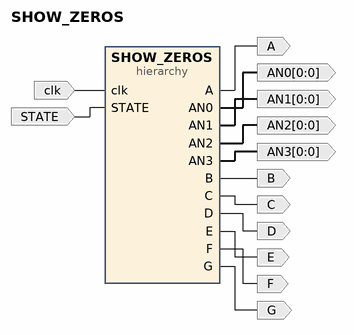
[diagram p0: block diagram of the top level]
# Vivado block design SHOW_ZEROS, xc7a35tcpg236-1, Vivado 2018.3
create_bd_design SHOW_ZEROS

create_bd_port -dir I clk
create_bd_port -dir I STATE
create_bd_port -dir O -from 0 -to 0 AN0
create_bd_port -dir O -from 0 -to 0 AN1
create_bd_port -dir O -from 0 -to 0 AN2
create_bd_port -dir O -from 0 -to 0 AN3
create_bd_port -dir O A
create_bd_port -dir O B
create_bd_port -dir O G
create_bd_port -dir O D
create_bd_port -dir O F
create_bd_port -dir O E
create_bd_port -dir O C

create_bd_cell -type hier SHOW_ZEROS

# ---- hierarchy /SHOW_ZEROS ----
current_bd_instance /SHOW_ZEROS
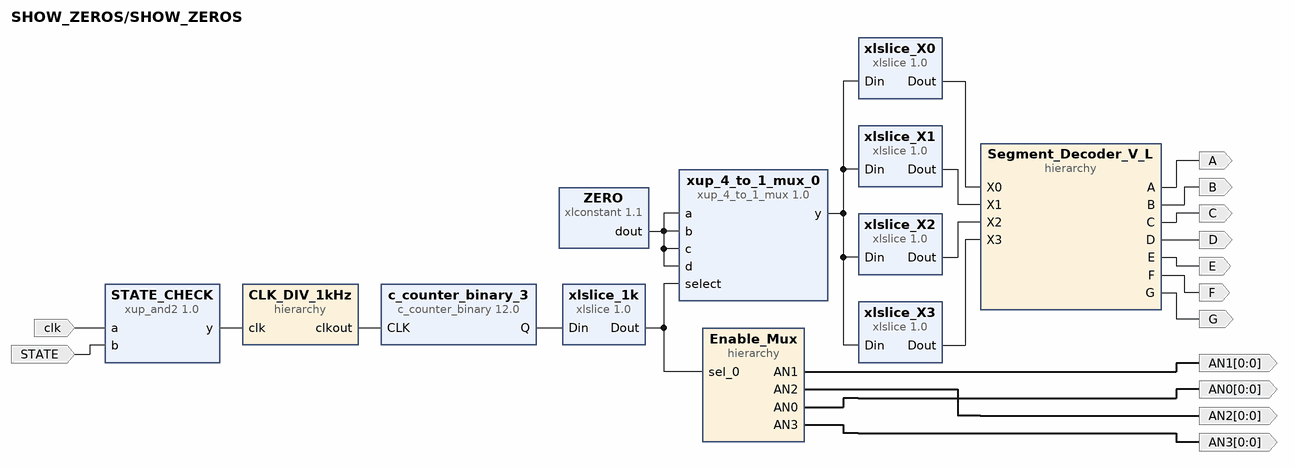
[diagram p1: block diagram inside /SHOW_ZEROS]
create_bd_pin -dir I clk
create_bd_pin -dir I STATE
create_bd_pin -dir O -from 0 -to 0 AN1
create_bd_pin -dir O -from 0 -to 0 AN2
create_bd_pin -dir O -from 0 -to 0 AN3
create_bd_pin -dir O -from 0 -to 0 AN0
create_bd_pin -dir O G
create_bd_pin -dir O B
create_bd_pin -dir O A
create_bd_pin -dir O D
create_bd_pin -dir O F
create_bd_pin -dir O E
create_bd_pin -dir O C

create_bd_cell -type ip -vlnv xilinx.com:xup:xup_4_to_1_mux:1.0 xup_4_to_1_mux_0
create_bd_cell -type ip -vlnv xilinx.com:xup:xup_and2:1.0 STATE_CHECK
create_bd_cell -type ip -vlnv xilinx.com:ip:xlslice:1.0 xlslice_X0
set_property -dict {CONFIG.DIN_FROM 0 CONFIG.DIN_TO 0 CONFIG.DIN_WIDTH 4} [get_bd_cells xlslice_X0]
create_bd_cell -type ip -vlnv xilinx.com:ip:xlslice:1.0 xlslice_1k
set_property -dict {CONFIG.DIN_FROM 1 CONFIG.DIN_TO 0 CONFIG.DIN_WIDTH 3 CONFIG.DOUT_WIDTH 2} [get_bd_cells xlslice_1k]
create_bd_cell -type ip -vlnv xilinx.com:ip:xlslice:1.0 xlslice_X1
set_property -dict {CONFIG.DIN_FROM 0 CONFIG.DIN_TO 0 CONFIG.DIN_WIDTH 4} [get_bd_cells xlslice_X1]
create_bd_cell -type ip -vlnv xilinx.com:ip:xlconstant:1.1 ZERO
set_property -dict {CONFIG.CONST_VAL 0} [get_bd_cells ZERO]
create_bd_cell -type ip -vlnv xilinx.com:ip:xlslice:1.0 xlslice_X2
set_property -dict {CONFIG.DIN_FROM 0 CONFIG.DIN_TO 0 CONFIG.DIN_WIDTH 4} [get_bd_cells xlslice_X2]
create_bd_cell -type ip -vlnv xilinx.com:ip:c_counter_binary:12.0 c_counter_binary_3
set_property -dict {CONFIG.Final_Count_Value 3 CONFIG.Output_Width 3 CONFIG.Restrict_Count true} [get_bd_cells c_counter_binary_3]
create_bd_cell -type ip -vlnv xilinx.com:ip:xlslice:1.0 xlslice_X3
set_property -dict {CONFIG.DIN_FROM 0 CONFIG.DIN_TO 0 CONFIG.DIN_WIDTH 4} [get_bd_cells xlslice_X3]
create_bd_cell -type hier Enable_Mux
create_bd_cell -type hier Segment_Decoder_V_L
create_bd_cell -type hier CLK_DIV_1kHz

# ---- hierarchy /SHOW_ZEROS/Enable_Mux ----
current_bd_instance /SHOW_ZEROS/Enable_Mux
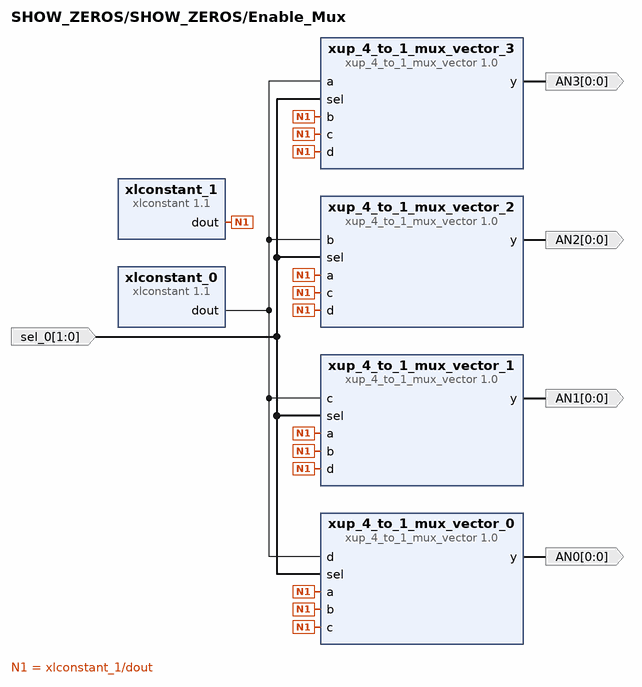
[diagram p2: block diagram inside /SHOW_ZEROS/Enable_Mux]
create_bd_pin -dir I -from 1 -to 0 sel_0
create_bd_pin -dir O -from 0 -to 0 AN1
create_bd_pin -dir O -from 0 -to 0 AN2
create_bd_pin -dir O -from 0 -to 0 AN3
create_bd_pin -dir O -from 0 -to 0 AN0

create_bd_cell -type ip -vlnv xilinx.com:xup:xup_4_to_1_mux_vector:1.0 xup_4_to_1_mux_vector_1
set_property -dict {CONFIG.DELAY 0 CONFIG.SIZE 1} [get_bd_cells xup_4_to_1_mux_vector_1]
create_bd_cell -type ip -vlnv xilinx.com:xup:xup_4_to_1_mux_vector:1.0 xup_4_to_1_mux_vector_2
set_property -dict {CONFIG.DELAY 0 CONFIG.SIZE 1} [get_bd_cells xup_4_to_1_mux_vector_2]
create_bd_cell -type ip -vlnv xilinx.com:xup:xup_4_to_1_mux_vector:1.0 xup_4_to_1_mux_vector_3
set_property -dict {CONFIG.DELAY 0 CONFIG.SIZE 1} [get_bd_cells xup_4_to_1_mux_vector_3]
create_bd_cell -type ip -vlnv xilinx.com:ip:xlconstant:1.1 xlconstant_0
set_property -dict {CONFIG.CONST_VAL 0} [get_bd_cells xlconstant_0]
create_bd_cell -type ip -vlnv xilinx.com:ip:xlconstant:1.1 xlconstant_1
create_bd_cell -type ip -vlnv xilinx.com:xup:xup_4_to_1_mux_vector:1.0 xup_4_to_1_mux_vector_0
set_property -dict {CONFIG.DELAY 0 CONFIG.SIZE 1} [get_bd_cells xup_4_to_1_mux_vector_0]

# ---- hierarchy /SHOW_ZEROS/Segment_Decoder_V_L ----
current_bd_instance /SHOW_ZEROS/Segment_Decoder_V_L
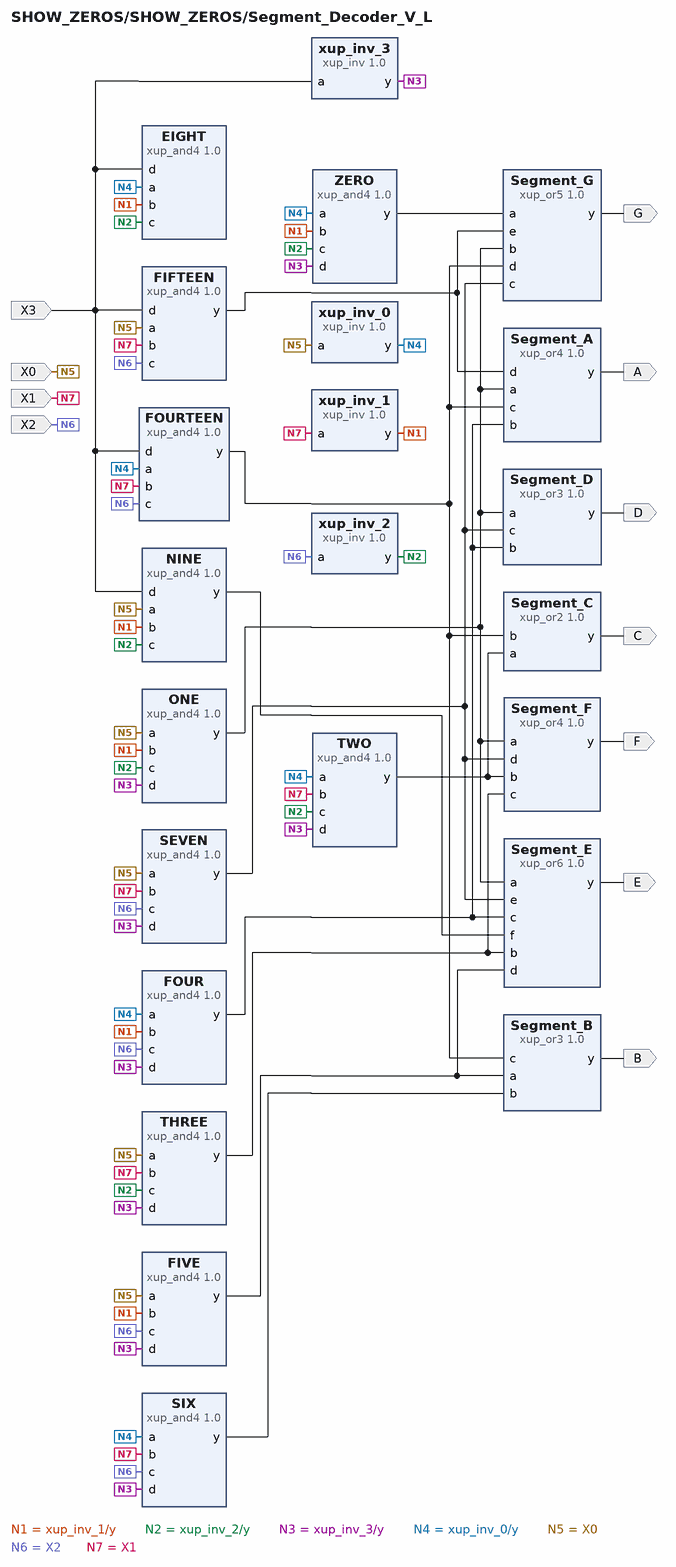
[diagram p3: block diagram inside /SHOW_ZEROS/Segment_Decoder_V_L]
create_bd_pin -dir I X0
create_bd_pin -dir O G
create_bd_pin -dir I X2
create_bd_pin -dir I X1
create_bd_pin -dir I X3
create_bd_pin -dir O B
create_bd_pin -dir O A
create_bd_pin -dir O D
create_bd_pin -dir O F
create_bd_pin -dir O E
create_bd_pin -dir O C

create_bd_cell -type ip -vlnv xilinx.com:xup:xup_and4:1.0 ONE
set_property -dict {CONFIG.DELAY 0} [get_bd_cells ONE]
create_bd_cell -type ip -vlnv xilinx.com:xup:xup_or5:1.0 Segment_G
set_property -dict {CONFIG.DELAY 0} [get_bd_cells Segment_G]
create_bd_cell -type ip -vlnv xilinx.com:xup:xup_and4:1.0 FOUR
set_property -dict {CONFIG.DELAY 0} [get_bd_cells FOUR]
create_bd_cell -type ip -vlnv xilinx.com:xup:xup_and4:1.0 FOURTEEN
set_property -dict {CONFIG.DELAY 0} [get_bd_cells FOURTEEN]
create_bd_cell -type ip -vlnv xilinx.com:xup:xup_and4:1.0 TWO
set_property -dict {CONFIG.DELAY 0} [get_bd_cells TWO]
create_bd_cell -type ip -vlnv xilinx.com:xup:xup_and4:1.0 FIVE
set_property -dict {CONFIG.DELAY 0} [get_bd_cells FIVE]
create_bd_cell -type ip -vlnv xilinx.com:xup:xup_or3:1.0 Segment_B
set_property -dict {CONFIG.DELAY 0} [get_bd_cells Segment_B]
create_bd_cell -type ip -vlnv xilinx.com:xup:xup_and4:1.0 SEVEN
set_property -dict {CONFIG.DELAY 0} [get_bd_cells SEVEN]
create_bd_cell -type ip -vlnv xilinx.com:xup:xup_or4:1.0 Segment_A
set_property -dict {CONFIG.DELAY 0} [get_bd_cells Segment_A]
create_bd_cell -type ip -vlnv xilinx.com:xup:xup_or3:1.0 Segment_D
set_property -dict {CONFIG.DELAY 0} [get_bd_cells Segment_D]
create_bd_cell -type ip -vlnv xilinx.com:xup:xup_and4:1.0 EIGHT
set_property -dict {CONFIG.DELAY 0} [get_bd_cells EIGHT]
create_bd_cell -type ip -vlnv xilinx.com:xup:xup_or4:1.0 Segment_F
set_property -dict {CONFIG.DELAY 0} [get_bd_cells Segment_F]
create_bd_cell -type ip -vlnv xilinx.com:xup:xup_or6:1.0 Segment_E
set_property -dict {CONFIG.DELAY 0} [get_bd_cells Segment_E]
create_bd_cell -type ip -vlnv xilinx.com:xup:xup_inv:1.0 xup_inv_0
set_property -dict {CONFIG.DELAY 0} [get_bd_cells xup_inv_0]
create_bd_cell -type ip -vlnv xilinx.com:xup:xup_and4:1.0 FIFTEEN
set_property -dict {CONFIG.DELAY 0} [get_bd_cells FIFTEEN]
create_bd_cell -type ip -vlnv xilinx.com:xup:xup_inv:1.0 xup_inv_1
set_property -dict {CONFIG.DELAY 0} [get_bd_cells xup_inv_1]
create_bd_cell -type ip -vlnv xilinx.com:xup:xup_and4:1.0 NINE
set_property -dict {CONFIG.DELAY 0} [get_bd_cells NINE]
create_bd_cell -type ip -vlnv xilinx.com:xup:xup_inv:1.0 xup_inv_2
set_property -dict {CONFIG.DELAY 0} [get_bd_cells xup_inv_2]
create_bd_cell -type ip -vlnv xilinx.com:xup:xup_and4:1.0 THREE
set_property -dict {CONFIG.DELAY 0} [get_bd_cells THREE]
create_bd_cell -type ip -vlnv xilinx.com:xup:xup_and4:1.0 SIX
set_property -dict {CONFIG.DELAY 0} [get_bd_cells SIX]
create_bd_cell -type ip -vlnv xilinx.com:xup:xup_inv:1.0 xup_inv_3
set_property -dict {CONFIG.DELAY 0} [get_bd_cells xup_inv_3]
create_bd_cell -type ip -vlnv xilinx.com:xup:xup_and4:1.0 ZERO
set_property -dict {CONFIG.DELAY 0} [get_bd_cells ZERO]
create_bd_cell -type ip -vlnv xilinx.com:xup:xup_or2:1.0 Segment_C
set_property -dict {CONFIG.DELAY 0} [get_bd_cells Segment_C]

# ---- hierarchy /SHOW_ZEROS/CLK_DIV_1kHz ----
current_bd_instance /SHOW_ZEROS/CLK_DIV_1kHz
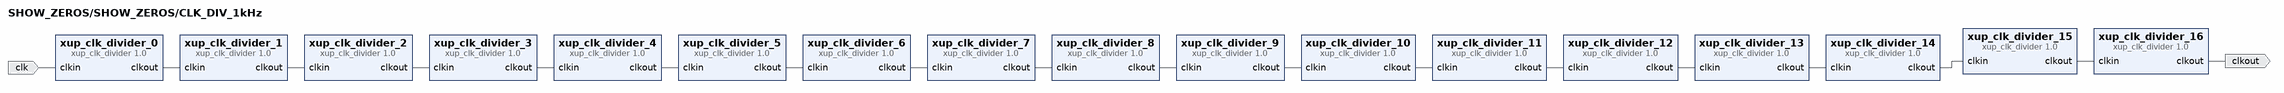
[diagram p4: block diagram inside /SHOW_ZEROS/CLK_DIV_1kHz]
create_bd_pin -dir O clkout
create_bd_pin -dir I clk

create_bd_cell -type ip -vlnv xilinx.com:xup:xup_clk_divider:1.0 xup_clk_divider_15
create_bd_cell -type ip -vlnv xilinx.com:xup:xup_clk_divider:1.0 xup_clk_divider_2
create_bd_cell -type ip -vlnv xilinx.com:xup:xup_clk_divider:1.0 xup_clk_divider_16
create_bd_cell -type ip -vlnv xilinx.com:xup:xup_clk_divider:1.0 xup_clk_divider_3
create_bd_cell -type ip -vlnv xilinx.com:xup:xup_clk_divider:1.0 xup_clk_divider_4
create_bd_cell -type ip -vlnv xilinx.com:xup:xup_clk_divider:1.0 xup_clk_divider_5
create_bd_cell -type ip -vlnv xilinx.com:xup:xup_clk_divider:1.0 xup_clk_divider_6
create_bd_cell -type ip -vlnv xilinx.com:xup:xup_clk_divider:1.0 xup_clk_divider_7
create_bd_cell -type ip -vlnv xilinx.com:xup:xup_clk_divider:1.0 xup_clk_divider_8
create_bd_cell -type ip -vlnv xilinx.com:xup:xup_clk_divider:1.0 xup_clk_divider_9
create_bd_cell -type ip -vlnv xilinx.com:xup:xup_clk_divider:1.0 xup_clk_divider_10
create_bd_cell -type ip -vlnv xilinx.com:xup:xup_clk_divider:1.0 xup_clk_divider_11
create_bd_cell -type ip -vlnv xilinx.com:xup:xup_clk_divider:1.0 xup_clk_divider_12
create_bd_cell -type ip -vlnv xilinx.com:xup:xup_clk_divider:1.0 xup_clk_divider_13
create_bd_cell -type ip -vlnv xilinx.com:xup:xup_clk_divider:1.0 xup_clk_divider_0
create_bd_cell -type ip -vlnv xilinx.com:xup:xup_clk_divider:1.0 xup_clk_divider_14
create_bd_cell -type ip -vlnv xilinx.com:xup:xup_clk_divider:1.0 xup_clk_divider_1

# ---- connections ----

current_bd_instance /SHOW_ZEROS
connect_bd_net [get_bd_pins ZERO/dout] \
  [get_bd_pins xup_4_to_1_mux_0/a] [get_bd_pins xup_4_to_1_mux_0/b] [get_bd_pins xup_4_to_1_mux_0/c] \
  [get_bd_pins xup_4_to_1_mux_0/d]
connect_bd_net [get_bd_pins xlslice_1k/Dout] [get_bd_pins xup_4_to_1_mux_0/select] [get_bd_pins Enable_Mux/sel_0]
connect_bd_net [get_bd_pins xup_4_to_1_mux_0/y] \
  [get_bd_pins xlslice_X0/Din] [get_bd_pins xlslice_X1/Din] [get_bd_pins xlslice_X2/Din] [get_bd_pins xlslice_X3/Din]
connect_bd_net -net xup_and2_0_y [get_bd_pins STATE_CHECK/y] [get_bd_pins CLK_DIV_1kHz/clk]
connect_bd_net [get_bd_pins xlslice_X0/Dout] [get_bd_pins Segment_Decoder_V_L/X0]
connect_bd_net [get_bd_pins c_counter_binary_3/Q] [get_bd_pins xlslice_1k/Din]
connect_bd_net [get_bd_pins xlslice_X1/Dout] [get_bd_pins Segment_Decoder_V_L/X1]
connect_bd_net [get_bd_pins xlslice_X2/Dout] [get_bd_pins Segment_Decoder_V_L/X2]
connect_bd_net [get_bd_pins CLK_DIV_1kHz/clkout] [get_bd_pins c_counter_binary_3/CLK]
connect_bd_net [get_bd_pins xlslice_X3/Dout] [get_bd_pins Segment_Decoder_V_L/X3]
connect_bd_net [get_bd_pins clk] [get_bd_pins STATE_CHECK/a]
connect_bd_net [get_bd_pins STATE] [get_bd_pins STATE_CHECK/b]
connect_bd_net [get_bd_pins Enable_Mux/AN1] [get_bd_pins AN1]
connect_bd_net [get_bd_pins Enable_Mux/AN2] [get_bd_pins AN2]
connect_bd_net [get_bd_pins Enable_Mux/AN3] [get_bd_pins AN3]
connect_bd_net [get_bd_pins Enable_Mux/AN0] [get_bd_pins AN0]
connect_bd_net [get_bd_pins Segment_Decoder_V_L/G] [get_bd_pins G]
connect_bd_net [get_bd_pins Segment_Decoder_V_L/B] [get_bd_pins B]
connect_bd_net [get_bd_pins Segment_Decoder_V_L/A] [get_bd_pins A]
connect_bd_net [get_bd_pins Segment_Decoder_V_L/D] [get_bd_pins D]
connect_bd_net [get_bd_pins Segment_Decoder_V_L/F] [get_bd_pins F]
connect_bd_net [get_bd_pins Segment_Decoder_V_L/E] [get_bd_pins E]
connect_bd_net [get_bd_pins Segment_Decoder_V_L/C] [get_bd_pins C]

current_bd_instance /SHOW_ZEROS/Enable_Mux
connect_bd_net [get_bd_pins xlconstant_1/dout] \
  [get_bd_pins xup_4_to_1_mux_vector_0/a] [get_bd_pins xup_4_to_1_mux_vector_0/b] [get_bd_pins xup_4_to_1_mux_vector_0/c] \
  [get_bd_pins xup_4_to_1_mux_vector_1/a] [get_bd_pins xup_4_to_1_mux_vector_1/b] [get_bd_pins xup_4_to_1_mux_vector_1/d] \
  [get_bd_pins xup_4_to_1_mux_vector_2/a] [get_bd_pins xup_4_to_1_mux_vector_2/c] [get_bd_pins xup_4_to_1_mux_vector_2/d] \
  [get_bd_pins xup_4_to_1_mux_vector_3/b] [get_bd_pins xup_4_to_1_mux_vector_3/c] [get_bd_pins xup_4_to_1_mux_vector_3/d]
connect_bd_net [get_bd_pins xlconstant_0/dout] \
  [get_bd_pins xup_4_to_1_mux_vector_0/d] [get_bd_pins xup_4_to_1_mux_vector_1/c] [get_bd_pins xup_4_to_1_mux_vector_2/b] \
  [get_bd_pins xup_4_to_1_mux_vector_3/a]
connect_bd_net [get_bd_pins sel_0] \
  [get_bd_pins xup_4_to_1_mux_vector_0/sel] [get_bd_pins xup_4_to_1_mux_vector_2/sel] \
  [get_bd_pins xup_4_to_1_mux_vector_3/sel] [get_bd_pins xup_4_to_1_mux_vector_1/sel]
connect_bd_net [get_bd_pins xup_4_to_1_mux_vector_1/y] [get_bd_pins AN1]
connect_bd_net [get_bd_pins xup_4_to_1_mux_vector_2/y] [get_bd_pins AN2]
connect_bd_net [get_bd_pins xup_4_to_1_mux_vector_3/y] [get_bd_pins AN3]
connect_bd_net [get_bd_pins xup_4_to_1_mux_vector_0/y] [get_bd_pins AN0]

current_bd_instance /SHOW_ZEROS/Segment_Decoder_V_L
connect_bd_net [get_bd_pins xup_inv_1/y] \
  [get_bd_pins ZERO/b] [get_bd_pins ONE/b] [get_bd_pins FOUR/b] [get_bd_pins FIVE/b] [get_bd_pins EIGHT/b] \
  [get_bd_pins NINE/b]
connect_bd_net [get_bd_pins xup_inv_2/y] \
  [get_bd_pins ZERO/c] [get_bd_pins ONE/c] [get_bd_pins TWO/c] [get_bd_pins THREE/c] [get_bd_pins EIGHT/c] \
  [get_bd_pins NINE/c]
connect_bd_net [get_bd_pins xup_inv_3/y] \
  [get_bd_pins ZERO/d] [get_bd_pins ONE/d] [get_bd_pins TWO/d] [get_bd_pins THREE/d] [get_bd_pins FOUR/d] \
  [get_bd_pins FIVE/d] [get_bd_pins SIX/d] [get_bd_pins SEVEN/d]
connect_bd_net [get_bd_pins ONE/y] \
  [get_bd_pins Segment_A/a] [get_bd_pins Segment_D/a] [get_bd_pins Segment_E/a] [get_bd_pins Segment_F/a] \
  [get_bd_pins Segment_G/b]
connect_bd_net [get_bd_pins ZERO/y] [get_bd_pins Segment_G/a]
connect_bd_net [get_bd_pins SEVEN/y] [get_bd_pins Segment_D/c] [get_bd_pins Segment_E/e] [get_bd_pins Segment_F/d] [get_bd_pins Segment_G/c]
connect_bd_net [get_bd_pins FOURTEEN/y] [get_bd_pins Segment_A/c] [get_bd_pins Segment_B/c] [get_bd_pins Segment_C/b] [get_bd_pins Segment_G/d]
connect_bd_net [get_bd_pins FIFTEEN/y] [get_bd_pins Segment_A/d] [get_bd_pins Segment_G/e]
connect_bd_net [get_bd_pins xup_inv_0/y] \
  [get_bd_pins ZERO/a] [get_bd_pins TWO/a] [get_bd_pins FOUR/a] [get_bd_pins SIX/a] [get_bd_pins EIGHT/a] \
  [get_bd_pins FOURTEEN/a]
connect_bd_net [get_bd_pins FOUR/y] [get_bd_pins Segment_A/b] [get_bd_pins Segment_D/b] [get_bd_pins Segment_E/c]
connect_bd_net [get_bd_pins TWO/y] [get_bd_pins Segment_C/a] [get_bd_pins Segment_F/b]
connect_bd_net [get_bd_pins FIVE/y] [get_bd_pins Segment_B/a] [get_bd_pins Segment_E/d]
connect_bd_net [get_bd_pins SIX/y] [get_bd_pins Segment_B/b]
connect_bd_net [get_bd_pins THREE/y] [get_bd_pins Segment_E/b] [get_bd_pins Segment_F/c]
connect_bd_net [get_bd_pins NINE/y] [get_bd_pins Segment_E/f]
connect_bd_net -net X0_1 [get_bd_pins X0] \
  [get_bd_pins xup_inv_0/a] [get_bd_pins THREE/a] [get_bd_pins FIVE/a] [get_bd_pins SEVEN/a] [get_bd_pins NINE/a] \
  [get_bd_pins FIFTEEN/a] [get_bd_pins ONE/a]
connect_bd_net -net xup_or3_1_y [get_bd_pins Segment_G/y] [get_bd_pins G]
connect_bd_net -net X2_1 [get_bd_pins X2] \
  [get_bd_pins xup_inv_2/a] [get_bd_pins FIVE/c] [get_bd_pins SIX/c] [get_bd_pins SEVEN/c] [get_bd_pins FOURTEEN/c] \
  [get_bd_pins FIFTEEN/c] [get_bd_pins FOUR/c]
connect_bd_net -net X1_1 [get_bd_pins X1] \
  [get_bd_pins xup_inv_1/a] [get_bd_pins TWO/b] [get_bd_pins THREE/b] [get_bd_pins SIX/b] [get_bd_pins SEVEN/b] \
  [get_bd_pins FIFTEEN/b] [get_bd_pins FOURTEEN/b]
connect_bd_net -net X3_1 [get_bd_pins X3] \
  [get_bd_pins xup_inv_3/a] [get_bd_pins EIGHT/d] [get_bd_pins NINE/d] [get_bd_pins FIFTEEN/d] [get_bd_pins FOURTEEN/d]
connect_bd_net -net xup_or2_0_y [get_bd_pins Segment_B/y] [get_bd_pins B]
connect_bd_net -net xup_or3_0_y [get_bd_pins Segment_A/y] [get_bd_pins A]
connect_bd_net -net xup_or3_0_y1 [get_bd_pins Segment_D/y] [get_bd_pins D]
connect_bd_net -net xup_or3_0_y3 [get_bd_pins Segment_F/y] [get_bd_pins F]
connect_bd_net -net xup_or3_0_y2 [get_bd_pins Segment_E/y] [get_bd_pins E]
connect_bd_net -net xup_or2_0_y1 [get_bd_pins Segment_C/y] [get_bd_pins C]

current_bd_instance /SHOW_ZEROS/CLK_DIV_1kHz
connect_bd_net -net xup_clk_divider_6_clkout1 [get_bd_pins xup_clk_divider_14/clkout] [get_bd_pins xup_clk_divider_15/clkin]
connect_bd_net [get_bd_pins xup_clk_divider_15/clkout] [get_bd_pins xup_clk_divider_16/clkin]
connect_bd_net [get_bd_pins xup_clk_divider_1/clkout] [get_bd_pins xup_clk_divider_2/clkin]
connect_bd_net [get_bd_pins xup_clk_divider_2/clkout] [get_bd_pins xup_clk_divider_3/clkin]
connect_bd_net [get_bd_pins xup_clk_divider_3/clkout] [get_bd_pins xup_clk_divider_4/clkin]
connect_bd_net [get_bd_pins xup_clk_divider_4/clkout] [get_bd_pins xup_clk_divider_5/clkin]
connect_bd_net [get_bd_pins xup_clk_divider_5/clkout] [get_bd_pins xup_clk_divider_6/clkin]
connect_bd_net [get_bd_pins xup_clk_divider_6/clkout] [get_bd_pins xup_clk_divider_7/clkin]
connect_bd_net [get_bd_pins xup_clk_divider_7/clkout] [get_bd_pins xup_clk_divider_8/clkin]
connect_bd_net -net xup_clk_divider_0_clkout1 [get_bd_pins xup_clk_divider_8/clkout] [get_bd_pins xup_clk_divider_9/clkin]
connect_bd_net -net xup_clk_divider_1_clkout1 [get_bd_pins xup_clk_divider_9/clkout] [get_bd_pins xup_clk_divider_10/clkin]
connect_bd_net -net xup_clk_divider_2_clkout1 [get_bd_pins xup_clk_divider_10/clkout] [get_bd_pins xup_clk_divider_11/clkin]
connect_bd_net -net xup_clk_divider_3_clkout1 [get_bd_pins xup_clk_divider_11/clkout] [get_bd_pins xup_clk_divider_12/clkin]
connect_bd_net -net xup_clk_divider_4_clkout1 [get_bd_pins xup_clk_divider_12/clkout] [get_bd_pins xup_clk_divider_13/clkin]
connect_bd_net -net xup_clk_divider_5_clkout1 [get_bd_pins xup_clk_divider_13/clkout] [get_bd_pins xup_clk_divider_14/clkin]
connect_bd_net [get_bd_pins xup_clk_divider_0/clkout] [get_bd_pins xup_clk_divider_1/clkin]
connect_bd_net [get_bd_pins xup_clk_divider_16/clkout] [get_bd_pins clkout]
connect_bd_net [get_bd_pins clk] [get_bd_pins xup_clk_divider_0/clkin]

current_bd_instance /
connect_bd_net [get_bd_ports clk] [get_bd_pins SHOW_ZEROS/clk]
connect_bd_net [get_bd_ports STATE] [get_bd_pins SHOW_ZEROS/STATE]
connect_bd_net -net Enable_Mux_AN1 [get_bd_pins SHOW_ZEROS/AN1] [get_bd_ports AN1]
connect_bd_net -net Enable_Mux_AN2 [get_bd_pins SHOW_ZEROS/AN2] [get_bd_ports AN2]
connect_bd_net -net Enable_Mux_AN3 [get_bd_pins SHOW_ZEROS/AN3] [get_bd_ports AN3]
connect_bd_net -net Enable_Mux_AN0 [get_bd_pins SHOW_ZEROS/AN0] [get_bd_ports AN0]
connect_bd_net -net Segment_Decoder_V_L_A [get_bd_pins SHOW_ZEROS/A] [get_bd_ports A]
connect_bd_net -net Segment_Decoder_V_L_B [get_bd_pins SHOW_ZEROS/B] [get_bd_ports B]
connect_bd_net -net Segment_Decoder_V_L_G [get_bd_pins SHOW_ZEROS/G] [get_bd_ports G]
connect_bd_net -net Segment_Decoder_V_L_D [get_bd_pins SHOW_ZEROS/D] [get_bd_ports D]
connect_bd_net -net Segment_Decoder_V_L_F [get_bd_pins SHOW_ZEROS/F] [get_bd_ports F]
connect_bd_net -net Segment_Decoder_V_L_E [get_bd_pins SHOW_ZEROS/E] [get_bd_ports E]
connect_bd_net -net Segment_Decoder_V_L_C [get_bd_pins SHOW_ZEROS/C] [get_bd_ports C]

validate_bd_design
save_bd_design
